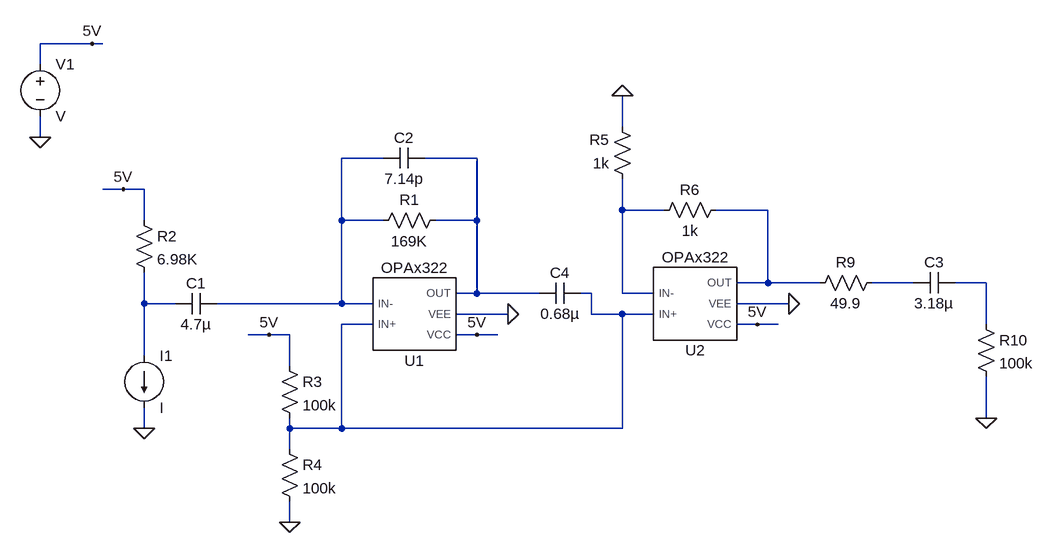
[diagram p0: schematic dual_amp_stage.asc]
dual_amp_stage.asc, the LTspice schematic file:
Version 4
SHEET 1 1616 896
WIRE -128 16 -208 16
WIRE -112 16 -128 16
WIRE -208 48 -208 16
WIRE 688 144 688 96
WIRE -208 160 -208 128
WIRE 320 192 256 192
WIRE 464 192 384 192
WIRE -80 240 -112 240
WIRE -48 240 -80 240
WIRE 688 272 688 224
WIRE 752 272 688 272
WIRE 912 272 832 272
WIRE -48 288 -48 240
WIRE 256 288 256 192
WIRE 320 288 256 288
WIRE 464 288 464 192
WIRE 464 288 400 288
WIRE 912 384 912 272
WIRE 912 384 864 384
WIRE 992 384 912 384
WIRE 1136 384 1072 384
WIRE 1248 384 1200 384
WIRE 464 400 464 288
WIRE 464 400 432 400
WIRE 560 400 464 400
WIRE 640 400 624 400
WIRE 688 400 688 272
WIRE 736 400 688 400
WIRE -48 416 -48 368
WIRE 0 416 -48 416
WIRE 256 416 256 288
WIRE 256 416 64 416
WIRE 304 416 256 416
WIRE 944 416 864 416
WIRE 512 432 432 432
WIRE 640 432 640 400
WIRE 688 432 640 432
WIRE 736 432 688 432
WIRE 304 448 256 448
WIRE 896 448 864 448
WIRE 928 448 896 448
WIRE 1248 448 1248 384
WIRE 144 464 112 464
WIRE 176 464 144 464
WIRE 464 464 432 464
WIRE 496 464 464 464
WIRE -48 496 -48 416
WIRE 176 512 176 464
WIRE 1248 592 1248 528
WIRE -48 608 -48 576
WIRE 176 608 176 592
WIRE 256 608 256 448
WIRE 256 608 176 608
WIRE 688 608 688 432
WIRE 688 608 256 608
WIRE 176 640 176 608
WIRE 176 752 176 720
FLAG -208 160 0
FLAG -128 16 5V
FLAG 896 448 5V
FLAG 944 416 0
FLAG 464 464 5V
FLAG 512 432 0
FLAG -80 240 5V
FLAG -48 608 0
FLAG 144 464 5V
FLAG 176 752 0
FLAG 1248 592 0
FLAG 688 96 0
SYMBOL OPAx322 368 432 M180
SYMATTR InstName U1
SYMBOL Voltage -208 32 R0
SYMATTR InstName V1
SYMBOL current -48 496 R0
SYMATTR InstName I1
SYMBOL Res 416 272 R90
WINDOW 0 0 56 VBottom 2
WINDOW 3 32 56 VTop 2
SYMATTR InstName R1
SYMATTR Value 169K
SYMBOL OPAx322 800 416 M180
SYMATTR InstName U2
SYMBOL cap 64 400 R90
WINDOW 0 0 32 VBottom 2
WINDOW 3 32 32 VTop 2
SYMATTR InstName C1
SYMATTR Value 4.7µ
SYMATTR SpiceLine Rser=0 Lser=0 mfg="Murata" pn="GRM188Z71C475ME21" type="X7R"
SYMBOL Res -64 272 R0
SYMATTR InstName R2
SYMATTR Value 6.98K
SYMBOL Cap 384 176 R90
WINDOW 0 0 32 VBottom 2
WINDOW 3 32 32 VTop 2
SYMATTR InstName C2
SYMATTR Value 7.14p
SYMBOL Res 160 496 R0
SYMATTR InstName R3
SYMATTR Value 100k
SYMBOL Res 160 624 R0
SYMATTR InstName R4
SYMATTR Value 100k
SYMBOL Res 704 240 R180
WINDOW 0 36 76 Left 2
WINDOW 3 36 40 Left 2
SYMATTR InstName R5
SYMATTR Value 1k
SYMBOL Res 848 256 R90
WINDOW 0 0 56 VBottom 2
WINDOW 3 32 56 VTop 2
SYMATTR InstName R6
SYMATTR Value 1k
SYMBOL Res 1088 368 R90
WINDOW 0 0 56 VBottom 2
WINDOW 3 32 56 VTop 2
SYMATTR InstName R9
SYMATTR Value 49.9
SYMBOL Cap 1200 368 R90
WINDOW 0 0 32 VBottom 2
WINDOW 3 32 32 VTop 2
SYMATTR InstName C3
SYMATTR Value 3.18µ
SYMBOL Res 1232 432 R0
SYMATTR InstName R10
SYMATTR Value 100k
SYMBOL Cap 624 384 R90
WINDOW 0 0 32 VBottom 2
WINDOW 3 32 32 VTop 2
SYMATTR InstName C4
SYMATTR Value 0.68µ

The netlist it stands for:
* dual_amp_stage.asc
XU1 N007 N001 5V 0 N002 OPAx322  ; pins IN+ IN- VCC VEE OUT
V1 5V 0 V
I1 N008 0 I
R1 N002 N001 169K
XU2 N007 N003 5V 0 N004 OPAx322  ; pins IN+ IN- VCC VEE OUT
C1 N001 N008 4.7µ Rser=0 Lser=0 mfg="Murata" pn="GRM188Z71C475ME21" type="X7R"
R2 5V N008 6.98K
C2 N002 N001 7.14p
R3 5V N007 100k
R4 N007 0 100k
R5 N003 0 1k
R6 N004 N003 1k
R9 N005 N004 49.9
C3 N006 N005 3.18µ
R10 N006 0 100k
C4 N007 N002 0.68µ
.lib /Users/nlin/Documents/ee/microphone/analysis/sbom888f/OPAx322.LIB
.backanno
.end